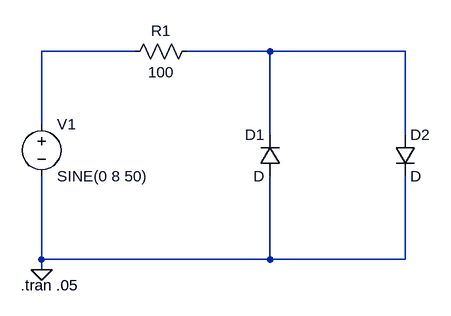
[diagram p0: schematic Diodo - Limitador_Diodo_Comum.asc]
Diodo - Limitador_Diodo_Comum.asc, the LTspice schematic file:
Version 4
SHEET 1 880 680
WIRE 144 80 0 80
WIRE 352 80 224 80
WIRE 560 80 352 80
WIRE 0 192 0 80
WIRE 352 208 352 80
WIRE 560 208 560 80
WIRE 0 400 0 272
WIRE 352 400 352 272
WIRE 352 400 0 400
WIRE 560 400 560 272
WIRE 560 400 352 400
WIRE 0 416 0 400
FLAG 0 416 0
SYMBOL voltage 0 176 R0
WINDOW 123 0 0 Left 2
WINDOW 39 0 0 Left 2
SYMATTR InstName V1
SYMATTR Value SINE(0 8 50)
SYMBOL res 128 96 R270
WINDOW 0 32 56 VTop 2
WINDOW 3 0 56 VBottom 2
SYMATTR InstName R1
SYMATTR Value 100
SYMBOL diode 368 272 R180
WINDOW 0 24 64 Left 2
WINDOW 3 24 0 Left 2
SYMATTR InstName D1
SYMBOL diode 544 208 R0
SYMATTR InstName D2
TEXT -32 440 Left 2 !.tran .05

The netlist it stands for:
* Diodo - Limitador_Diodo_Comum.asc
V1 N001 0 SINE(0 8 50)
R1 N001 N002 100
D1 0 N002 D
D2 N002 0 D
.model D D
.lib standard.dio
.tran .05
.backanno
.end